# Altium schematic sheet Motordriver.SchDoc
size A3
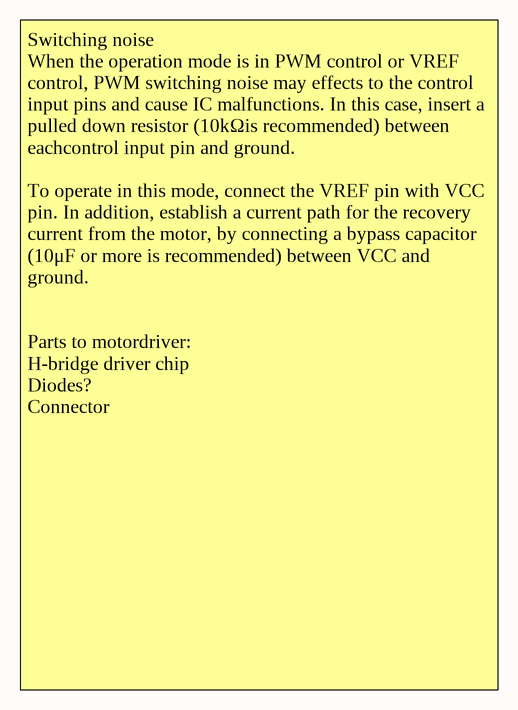
[diagram p0: Motordriver.SchDoc]

## Notes on the sheet
- Switching noise
  When the operation mode is in PWM control or VREF control, PWM switching noise may effects to the control input pins and cause IC malfunctions. In this case, insert a pulled down resistor (10kΩis recommended) between eachcontrol input pin and ground.
  To operate in this mode, connect the VREF pin with VCC pin. In addition, establish a current path for the recovery current from the motor, by connecting a bypass capacitor (10μF or more is recommended) between VCC and ground.
  Parts to motordriver:
  H-bridge driver chip
  Diodes?
  Connector